# Altium schematic sheet SPLIT4.SchDoc
size 431 x 279 mm
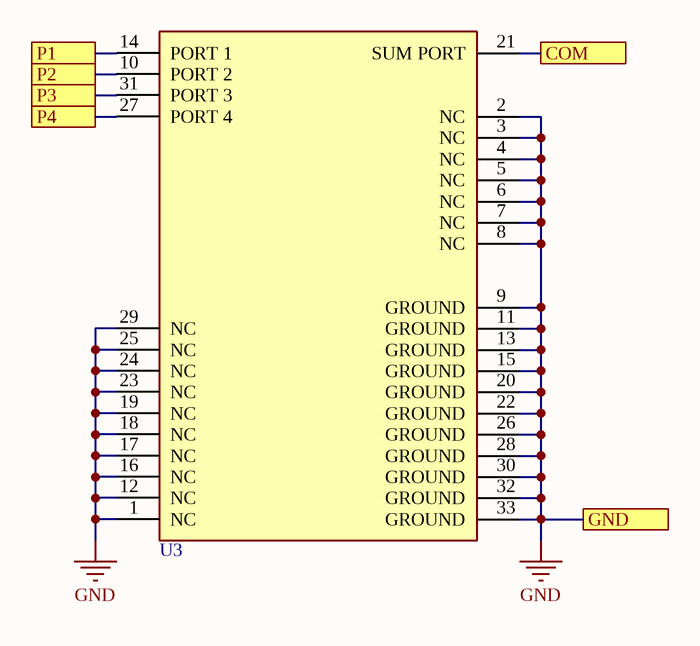
[diagram p0: SPLIT4.SchDoc]

## Parts
U3  EP4RKU+  [EP4RKU+]  (value not drawn)

## Ports
COM, GND, P1, P2, P3, P4

## Nets
GND: U3.1(NC) U3.2(NC) U3.3(NC) U3.4(NC) U3.5(NC) U3.6(NC) U3.7(NC) U3.8(NC) U3.9(GROUND) U3.11(GROUND) U3.12(NC) U3.13(GROUND) U3.15(GROUND) U3.16(NC) U3.17(NC) U3.18(NC) U3.19(NC) U3.20(GROUND) U3.22(GROUND) U3.23(NC) U3.24(NC) U3.25(NC) U3.26(GROUND) U3.28(GROUND) U3.29(NC) U3.30(GROUND) U3.32(GROUND) U3.33(GROUND) ; port GND
COM: U3.21(SUM_PORT) ; port COM
P1: U3.14(PORT_1) ; port P1
P2: U3.10(PORT_2) ; port P2
P3: U3.31(PORT_3) ; port P3
P4: U3.27(PORT_4) ; port P4

## Notes on the sheet
- DWG. NO.
- REV.
- SHT.
- THIS DOCUMENT AND THE DATA DISCLOSED HEREIN OR HEREWITH IS THE PROPERTY OF ALTIUM LIMITED AND MAY BE FREELY DISTRIBUTED IN WHOLE. NO RIGHTS ARE RESERVED OR EXPRESS OR IMPLIED WARANTEE GIVEN.
- REVISION
- DESCRIPTION
- DATE
- APPROVED
- ENG:
- APPROVALS
- PROJECT
- DSN:
- CHK:
- REFERENCE DOCUMENTS
- PROJECT REVISION:
- TITLE
- DOCUMENT REVISION:
- DESIGN ITEM:
- BOM:
- FAB DWG:
- PCB DWG:
- ASSY DWG:
- SCALE:
- SIZE
- B
- CAGE CODE
- FILE NAME
- DWG NO.
- SHEET
- OF
- REV

## Library data of the parts
U3 = EP4RKU+: Power Splitter/Combiner 4 Way-0° 50Ω DC to 18 GHz